# Altium schematic sheet lora.SchDoc: LoRa Modem
size A4; Organization: Tweetonig; Address1: Delftsestraat 11; DocumentNumber: 8; Revision: 1.0; SheetNumber: 8; SheetTotal: 9
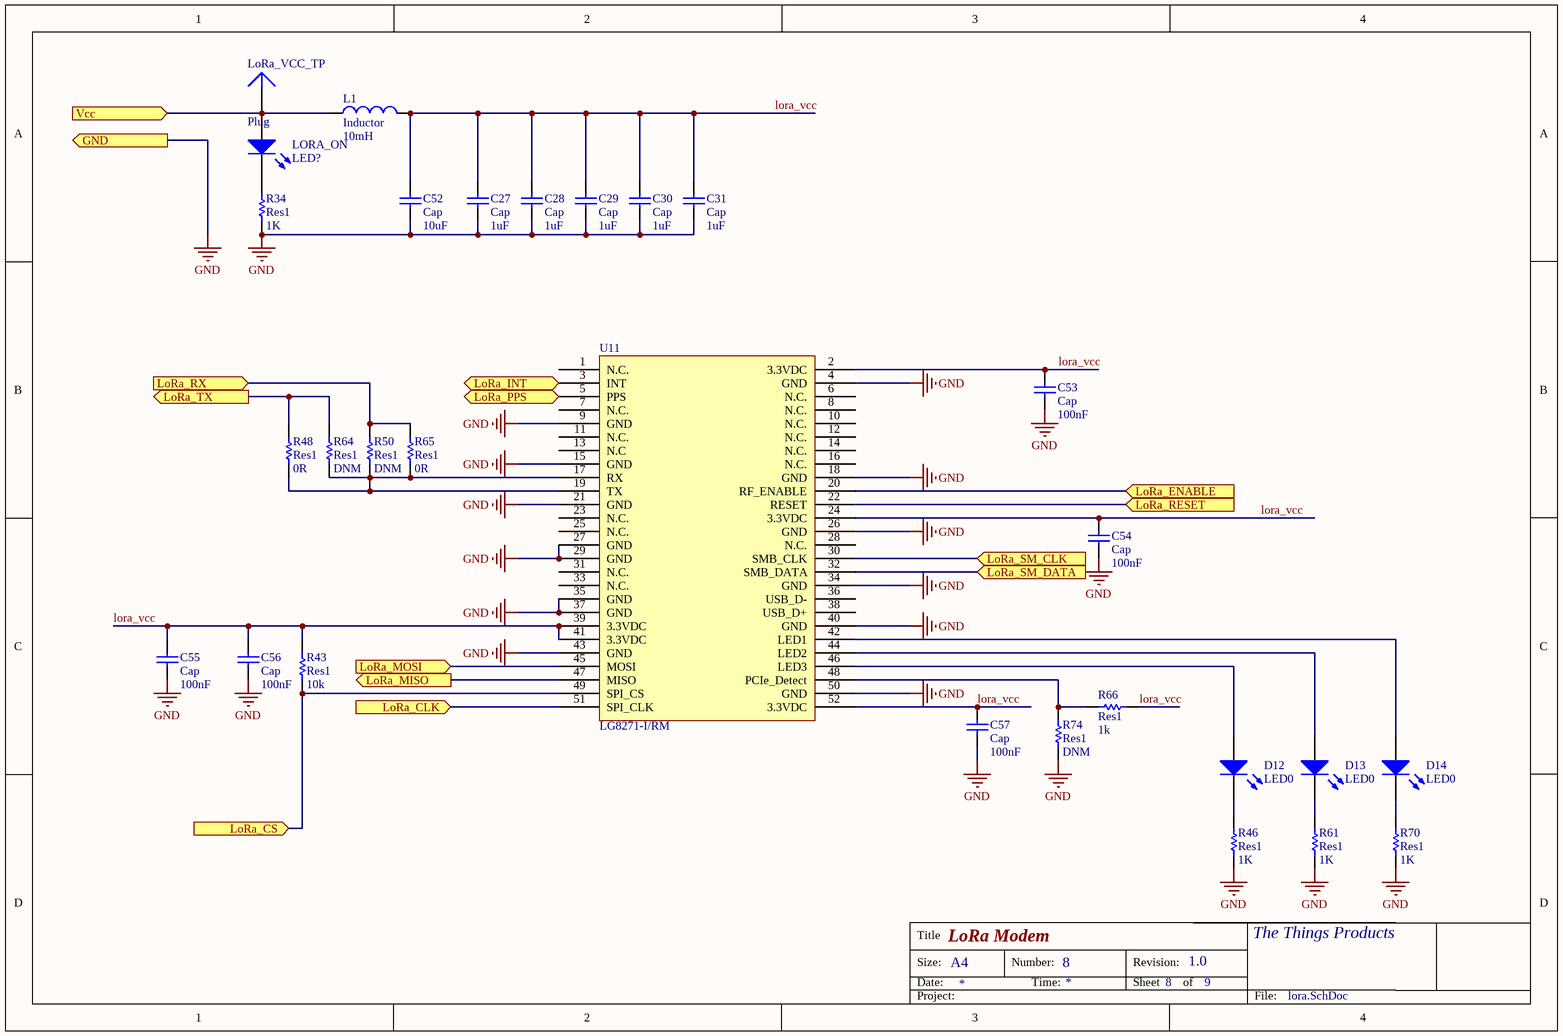
[diagram p0: lora.SchDoc]

## Parts
C27  Cap  value 1uF  [C1206]
C28  Cap  value 1uF  [C1206]
C29  Cap  value 1uF  [C1206]
C30  Cap  value 1uF  [C1206]
C31  Cap  value 1uF  [C1206]
C52  Cap  value 10uF  [C1206]
C53  Cap  value 100nF  [C0603]
C54  Cap  value 100nF  [C0603]
C55  Cap  value 100nF  [C0603]
C56  Cap  value 100nF  [C0603]
C57  Cap  value 100nF  [C0603]
D12  LED0  [C0603]
D13  LED0  [C0603]
D14  LED0  [C0603]
L1  Inductor  value 10mH  [2029]
LORA_ON  LED?  [C0603]
LoRa_VCC_TP  Plug  [PIN1]
R34  Res1  value 1K  [R0603]
R43  Res1  value 10k  [R0603]
R46  Res1  value 1K  [R0603]
R48  Res1  value 0R  [R0603]
R50  Res1  value DNM  [R0603]
R61  Res1  value 1K  [R0603]
R64  Res1  value DNM  [R0603]
R65  Res1  value 0R  [R0603]
R66  Res1  value 1k  [R0603]
R70  Res1  value 1K  [R0603]
R74  Res1  value DNM  [R0603]
U11  LG8271-I/RM  [BTB-SM0-8-2H52F]

## Ports
GND (out), LoRa_CLK (in), LoRa_CS (in), LoRa_ENABLE (in), LoRa_INT (out), LoRa_MISO (out), LoRa_MOSI (in), LoRa_PPS (in), LoRa_RESET (in), LoRa_RX (in), LoRa_SM_CLK (in), LoRa_SM_DATA (in), LoRa_TX (out), Vcc (in)

## Nets
GND: C27.1 C28.1 C29.1 C30.1 C31.1 C52.1 C53.1 C54.1 C55.1 C56.1 C57.1 R34.1 R46.1 R61.1 R70.1 R74.1 U11.4(GND) U11.9(GND) U11.15(GND) U11.18(GND) U11.21(GND) U11.26(GND) U11.27(GND) U11.29(GND) U11.34(GND) U11.35(GND) U11.37(GND) U11.40(GND) U11.43(GND) U11.50(GND) ; port GND
LoRa_CLK: U11.51(SPI_CLK) ; port LoRa_CLK
LoRa_CS: R43.1 U11.49(SPI_CS) ; port LoRa_CS
LoRa_ENABLE: U11.20(RF_ENABLE) ; port LoRa_ENABLE
LoRa_INT: U11.3(INT) ; port LoRa_INT
LoRa_MISO: U11.47(MISO) ; port LoRa_MISO
LoRa_MOSI: U11.45(MOSI) ; port LoRa_MOSI
LoRa_PPS: U11.5(PPS) ; port LoRa_PPS
LoRa_RESET: U11.22(RESET) ; port LoRa_RESET
LoRa_RX: R50.2 R65.1 ; port LoRa_RX
LoRa_SM_CLK: U11.30(SMB_CLK) ; port LoRa_SM_CLK
LoRa_SM_DATA: U11.32(SMB_DATA) ; port LoRa_SM_DATA
LoRa_TX: R48.2 R64.2 ; port LoRa_TX
lora_vcc: C27.2 C28.2 C29.2 C30.2 C31.2 C52.2 C53.2 C54.2 C55.2 C56.2 C57.2 L1.2 R43.2 R66.1 U11.2(3.3VDC) U11.24(3.3VDC) U11.39(3.3VDC) U11.41(3.3VDC) U11.52(3.3VDC)
Vcc: L1.1 LORA_ON.1(A) LoRa_VCC_TP.1 ; port Vcc
NetD12_1: D12.1(A) U11.46(LED3)
NetD12_2: D12.2(K) R46.2
NetD13_1: D13.1(A) U11.44(LED2)
NetD13_2: D13.2(K) R61.2
NetD14_1: D14.1(A) U11.42(LED1)
NetD14_2: D14.2(K) R70.2
NetLORA_ON_2: LORA_ON.2(K) R34.2
NetR48_1: R48.1 R50.1 R64.1 R65.2 U11.17(RX) U11.19(TX)
NetR66_2: R66.2 R74.2 U11.48(PCIe_Detect)

Not connected (* = marked no-connect by the designer): U11 1(N.C.) 6(N.C.) 7(N.C.) 8(N.C.) 10(N.C.) 11(N.C.) 12(N.C.) 13(N.C) 14(N.C.) 16(N.C.) 23(N.C.) 25(N.C.) 28(N.C.) 31(N.C.) 33(N.C.) 36(USB_D-) 38(USB_D+)

## Notes on the sheet
- Title
- Size:
- Date:
- A4
- Number:
- Time:
- Revision:
- Sheet
- of
- The Things Products
- Project:
- File:

## Library data of the parts
C27-C31 C52-C57 = Cap: Capacitor; Published: 8-Jun-2000; LatestRevisionDate: 17-Jul-2002; LatestRevisionNote: Re-released for DXP Platform.; PackageReference: RAD-0.3; Publisher: Altium Limited; PackageDescription: Radial Cap, Thru-Hole; 2 Leads; 0.3 in Pin Spacing
D12-D14 LORA_ON = LED0: Typical INFRARED GaAs LED; Published: 8-Jun-2000; LatestRevisionDate: 08-Jul-2005; LatestRevisionNote: Mech Layer 1 removed.; PackageReference: LED-0; Publisher: Altium Limited; PackageDescription: LED; 2 Leads
L1 = Inductor: Code_IEC: 1005; Published: 8-Jun-2000; LatestRevisionDate: 29-May-2009; LatestRevisionNote: IPC-7351 Footprint Added.; PackageReference: 0402-A; Publisher: Altium Limited; PackageDescription: Chip Inductor; Code_JEITA: 0402
R34 R43 R46 R48 R50 R61 R64-R66 R70 R74 = Res1: Resistor; Published: 8-Jun-2000; LatestRevisionDate: 17-Jul-2002; LatestRevisionNote: Re-released for DXP Platform.; PackageReference: AXIAL-0.3; Publisher: Altium Limited; PackageDescription: Axial Device, Thru-Hole; 2 Leads; 0.3 in Pin Spacing
U11 = MCP LoRa Gateway: Microchip Mini PCI Express LoRa Radio
LoRa_VCC_TP = Plug: LatestRevisionDate: 17-Jul-2002; LatestRevisionNote: Re-released for DXP Platform.; Publisher: Altium Limited